# Altium schematic sheet Connectors-HDMI-MicroSD.SchDoc
size A4; SheetNumber: 2; SheetTotal: 6
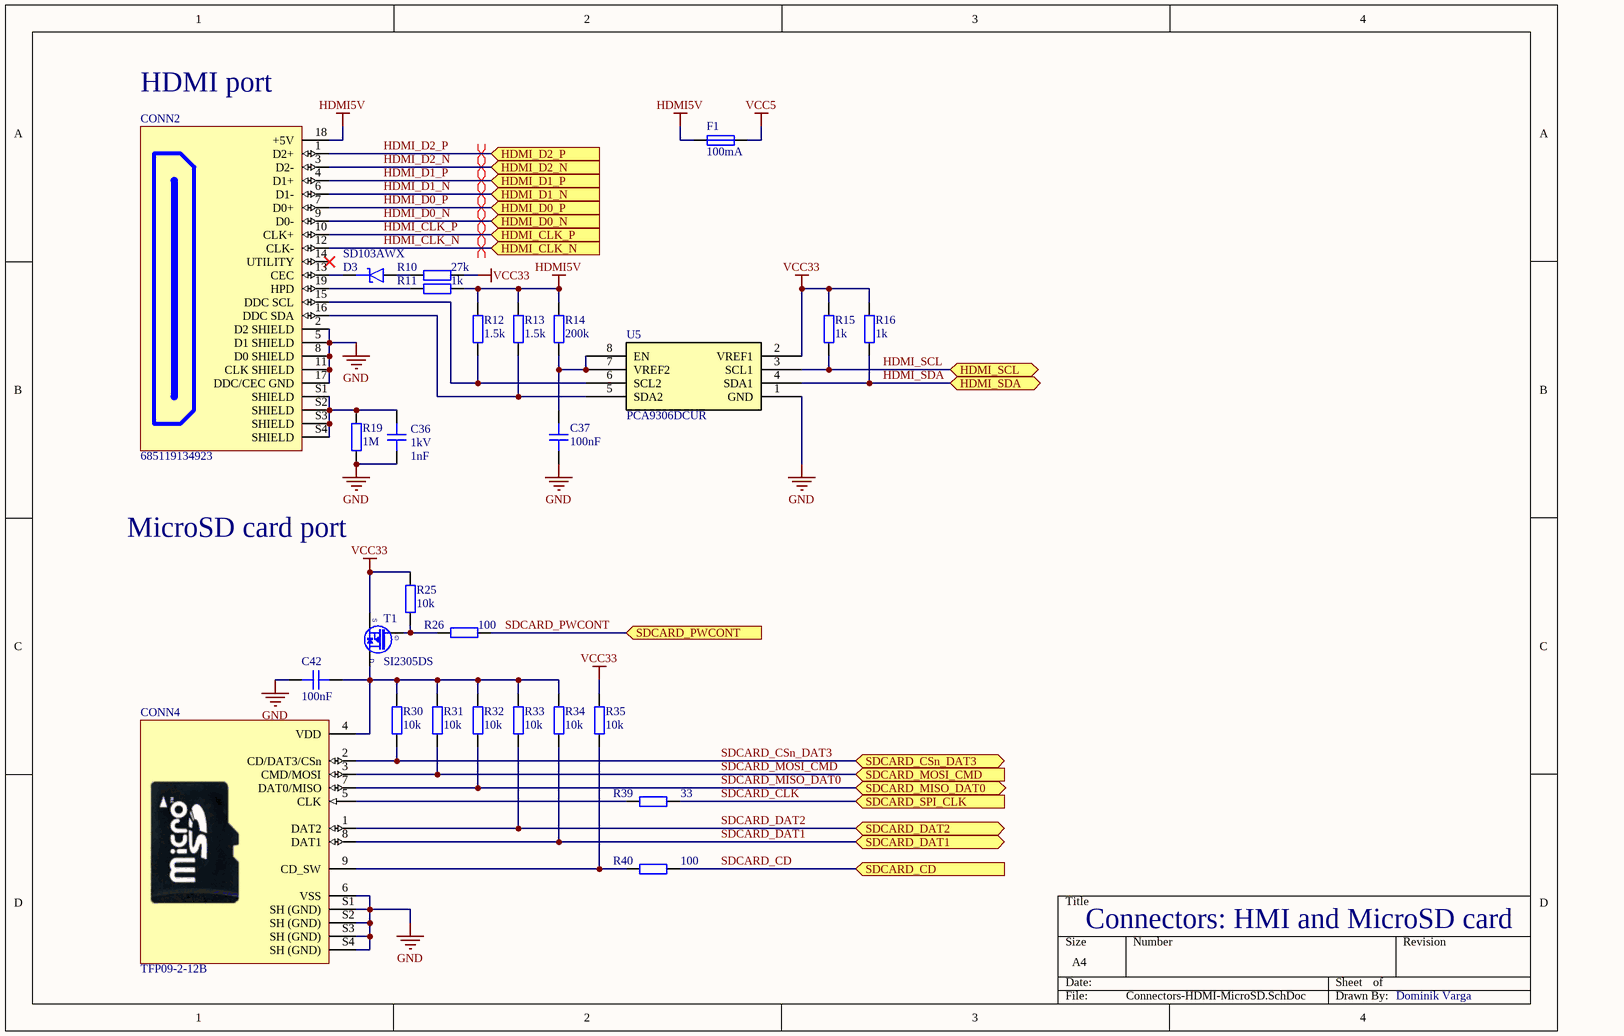
[diagram p0: Connectors-HDMI-MicroSD.SchDoc]

## Parts
C36  1nF  Voltage: 1kV  [CAP_SMD0805]
C37  100nF  [CAP_SMD0603]
C42  100nF  [CAP_SMD0603]
CONN2  685119134923  [685119134923]
CONN4  TFP09-2-12B  [TFP09-2-12B]
D3  SD103AWX  [SODFL1608X70N]
F1  100mA  [RES_SMD1206]
R10  27k  [RES_SMD0603]
R11  1k  [RES_SMD0603]
R12  1.5k  [RES_SMD0603]
R13  1.5k  [RES_SMD0603]
R14  200k  [RES_SMD0603]
R15  1k  [RES_SMD0603]
R16  1k  [RES_SMD0603]
R19  1M  [RES_SMD0805]
R25  10k  [RES_SMD0603]
R26  100  [RES_SMD0603]
R30  10k  [RES_SMD0603]
R31  10k  [RES_SMD0603]
R32  10k  [RES_SMD0603]
R33  10k  [RES_SMD0603]
R34  10k  [RES_SMD0603]
R35  10k  [RES_SMD0603]
R39  33  [RES_SMD0603]
R40  100  [RES_SMD0603]
T1  SI2305DS  [SOT95P240X110-3N]
U5  PCA9306DCUR  [SOP50P310X90-8N]

## Ports
HDMI_CLK_N (in, see FPGA-IO-BANKS[2B]), HDMI_CLK_P (in, see FPGA-IO-BANKS[2B]), HDMI_D0_N (in, see FPGA-IO-BANKS[2B]), HDMI_D0_P (in, see FPGA-IO-BANKS[2B]), HDMI_D1_N (in, see FPGA-IO-BANKS[2B]), HDMI_D1_P (in, see FPGA-IO-BANKS[2B]), HDMI_D2_N (in, see FPGA-IO-BANKS[2B]), HDMI_D2_P (in, see FPGA-IO-BANKS[2B]), HDMI_SCL (bidir, see FPGA-IO-BANKS[2B]), HDMI_SDA (bidir, see FPGA-IO-BANKS[2B]), SDCARD_CD (in, see FPGA-IO-BANKS[3B]), SDCARD_CSn_DAT3 (bidir, see FPGA-IO-BANKS[3B]), SDCARD_DAT1 (bidir, see FPGA-IO-BANKS[3B]), SDCARD_DAT2 (bidir, see FPGA-IO-BANKS[3B]), SDCARD_MISO_DAT0 (bidir, see FPGA-IO-BANKS[3B]), SDCARD_MOSI_CMD (in, see FPGA-IO-BANKS[3B]), SDCARD_PWCONT (in, see FPGA-IO-BANKS[3B]), SDCARD_SPI_CLK (in, see FPGA-IO-BANKS[3B])

## Nets
GND: C36.1 C37.1 C42.2 CONN2.2(D2_SHIELD) CONN2.5(D1_SHIELD) CONN2.8(D0_SHIELD) CONN2.11(CLK_SHIELD) CONN2.17(DDC/CEC_GND) CONN4.6(VSS) CONN4.S1(SH_(GND)) CONN4.S2(SH_(GND)) CONN4.S3(SH_(GND)) CONN4.S4(SH_(GND)) R19.1 U5.1(GND)
HDMI5V: CONN2.18(+5V) F1.1 R11.1 R12.2 R13.2 R14.2
VCC5: F1.2
VCC33: R10.1 R15.2 R16.2 R25.1 R35.1 T1.2(S) U5.2(VREF1)
HDMI_CLK_N: CONN2.12(CLK-) ; port HDMI_CLK_N
HDMI_CLK_P: CONN2.10(CLK+) ; port HDMI_CLK_P
HDMI_D0_N: CONN2.9(D0-) ; port HDMI_D0_N
HDMI_D0_P: CONN2.7(D0+) ; port HDMI_D0_P
HDMI_D1_N: CONN2.6(D1-) ; port HDMI_D1_N
HDMI_D1_P: CONN2.4(D1+) ; port HDMI_D1_P
HDMI_D2_N: CONN2.3(D2-) ; port HDMI_D2_N
HDMI_D2_P: CONN2.1(D2+) ; port HDMI_D2_P
HDMI_SCL: R15.1 U5.3(SCL1) ; port HDMI_SCL
HDMI_SDA: R16.1 U5.4(SDA1) ; port HDMI_SDA
SDCARD_CD: R40.1 ; port SDCARD_CD
SDCARD_CLK: R39.1 ; port SDCARD_SPI_CLK
SDCARD_CSn_DAT3: CONN4.2(CD/DAT3/CSn) R30.2 ; port SDCARD_CSn_DAT3
SDCARD_DAT1: CONN4.8(DAT1) R34.2 ; port SDCARD_DAT1
SDCARD_DAT2: CONN4.1(DAT2) R33.2 ; port SDCARD_DAT2
SDCARD_MISO_DAT0: CONN4.7(DAT0/MISO) R32.2 ; port SDCARD_MISO_DAT0
SDCARD_MOSI_CMD: CONN4.3(CMD/MOSI) R31.2 ; port SDCARD_MOSI_CMD
SDCARD_PWCONT: R26.1 ; port SDCARD_PWCONT
NetC36_2: C36.2 CONN2.S1(SHIELD) CONN2.S2(SHIELD) CONN2.S3(SHIELD) CONN2.S4(SHIELD) R19.2
NetC37_2: C37.2 R14.1 U5.7(VREF2) U5.8(EN)
NetC42_1: C42.1 CONN4.4(VDD) R30.1 R31.1 R32.1 R33.1 R34.1 T1.3(D)
NetCONN2_13: CONN2.13(CEC) D3.1(K)
NetCONN2_15: CONN2.15(DDC_SCL) R12.1 U5.6(SCL2)
NetCONN2_16: CONN2.16(DDC_SDA) R13.1 U5.5(SDA2)
NetCONN2_19: CONN2.19(HPD) R11.2
NetCONN4_5: CONN4.5(CLK) R39.2
NetCONN4_9: CONN4.9(CD_SW) R35.2 R40.2
NetD3_2: D3.2(A) R10.2
NetR25_2: R25.2 R26.2 T1.1(G)

Not connected (* = marked no-connect by the designer): CONN2 14(UTILITY)*

## Layout directives
differential pair: HDMI_CLK_N, HDMI_CLK_P, HDMI_D0_N, HDMI_D0_P, HDMI_D1_N, HDMI_D1_P, HDMI_D2_N, HDMI_D2_P

## Notes on the sheet
- (near CONN2) HDMI port
- MicroSD card port
- Connectors: HMI and MicroSD card
- Dominik Varga

## Library data of the parts
C36 = CAP_0603: Capacitor SMD 0805
C37 C42 = CAP_0603: Capacitor SMD 0603
CONN2 = 685119134923: Würth Elektronik 685119134923 HDMI type A receptacle
CONN4 = TFP09-2-12B: MicroSD card socket
D3 = SD103AWX: Schottky Barrier Diode
F1 = FUSE_1206: Fuse SMD 1206; Manufacturer: *; Manufacturer Part Number: *
R10-R16 R25 R26 R30-R35 R39 R40 = RES_0603: Resistor SMD 0603
R19 = RES_0603: Resistor SMD 0805
T1 = P-MOSFET: P-CHANNEL MOSFET WITH DIODE SI2305DS; Part Number: BSH203; Part Description: -30V -470mA P-Channel Enhancement Mode MOS Transistor; Manufacturer: NXP SEMICONDUCTORS; PressFit: No; Bonding: No; Component Kind: Standard; Component Type: Standard; Device: BSH203; Footprint: SOT95P230X110-3N; PackageDescription: SOT23, 0.95mm Pitch; 3 Pin, 1.30mm W X 2.90mm L X 1.10mm H body, IPC Medium Density; Manufacturer Part Number: BSH203; Pin Count: 3; Case: SOT23-3; Mounted: Yes; Socket: No; SMD: Yes; Sense: No; ComponentHeight: 1.1mm; HelpURL: \\cern.ch\dfs\Applications\Altium\Datasheets\BSH203.pdf; Author: CERN DEM JLC; CreateDate: 2010. 05. 10.; LatestRevisionDate: 2010. 05. 10.
U5 = PCA9306DCUR: 2-bit bidirectional 400-kHz I2C/SMBus voltage level translator 8-VSSOP -40 to 85; Mfr_Name: Texas Instruments; Copyright: Copyright (C) 2023 Ultra Librarian. All rights reserved.; Manufacturer_Part_Number: PCA9306DCUR; RefDes: RefDes; Type: DEV